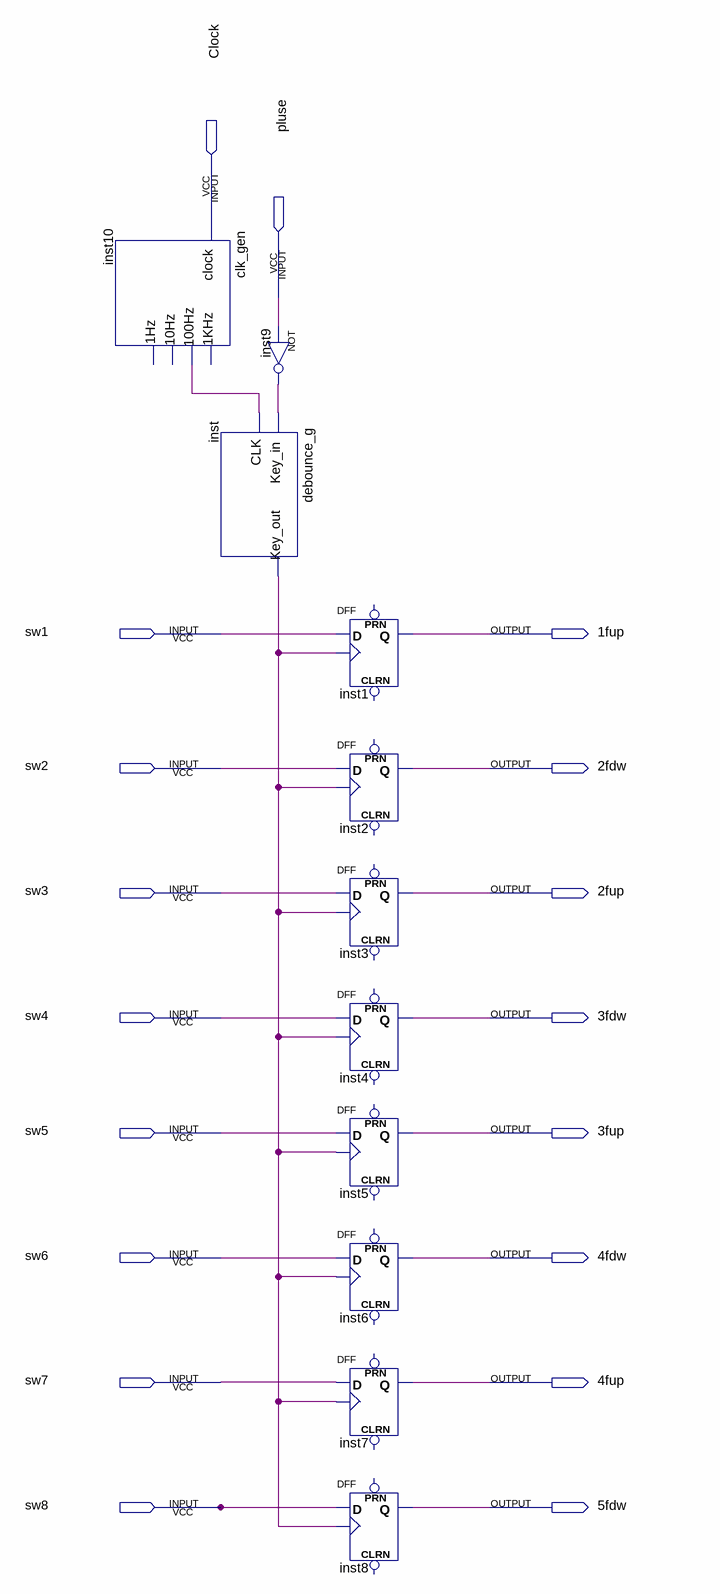
[diagram p0: schematic sheet]
// Quartus schematic outsideinput.bdf as structural Verilog: 11 symbols, 18 pins
module outsideinput (
  input  Clock,
  input  pluse,
  input  sw1,
  input  sw2,
  input  sw3,
  input  sw4,
  input  sw5,
  input  sw6,
  input  sw7,
  input  sw8,
  output \1fup ,
  output \2fdw ,
  output \2fup ,
  output \3fdw ,
  output \3fup ,
  output \4fdw ,
  output \4fup ,
  output \5fdw 
);

  wire inst9_out, inst10_100hz, inst_key_out;

  clk_gen inst10 (.clock(Clock), .\100Hz (inst10_100hz));  // open: 1KHz, 10Hz, 1Hz
  debounce_g inst (.Key_in(inst9_out), .CLK(inst10_100hz), .Key_out(inst_key_out));
  not inst9 (inst9_out, pluse);
  DFF inst1 (.CLK(inst_key_out), .D(sw1), .Q(\1fup ));  // open: CLRN, PRN
  DFF inst2 (.CLK(inst_key_out), .D(sw2), .Q(\2fdw ));  // open: CLRN, PRN
  DFF inst3 (.CLK(inst_key_out), .D(sw3), .Q(\2fup ));  // open: CLRN, PRN
  DFF inst4 (.CLK(inst_key_out), .D(sw4), .Q(\3fdw ));  // open: CLRN, PRN
  DFF inst5 (.CLK(inst_key_out), .D(sw5), .Q(\3fup ));  // open: CLRN, PRN
  DFF inst6 (.CLK(inst_key_out), .D(sw6), .Q(\4fdw ));  // open: CLRN, PRN
  DFF inst7 (.CLK(inst_key_out), .D(sw7), .Q(\4fup ));  // open: CLRN, PRN
  DFF inst8 (.CLK(inst_key_out), .D(sw8), .Q(\5fdw ));  // open: CLRN, PRN
endmodule
